# EAGLE design BLT_Small_Inflight_PCB_Oct_4 (EAGLE 9.6.2)
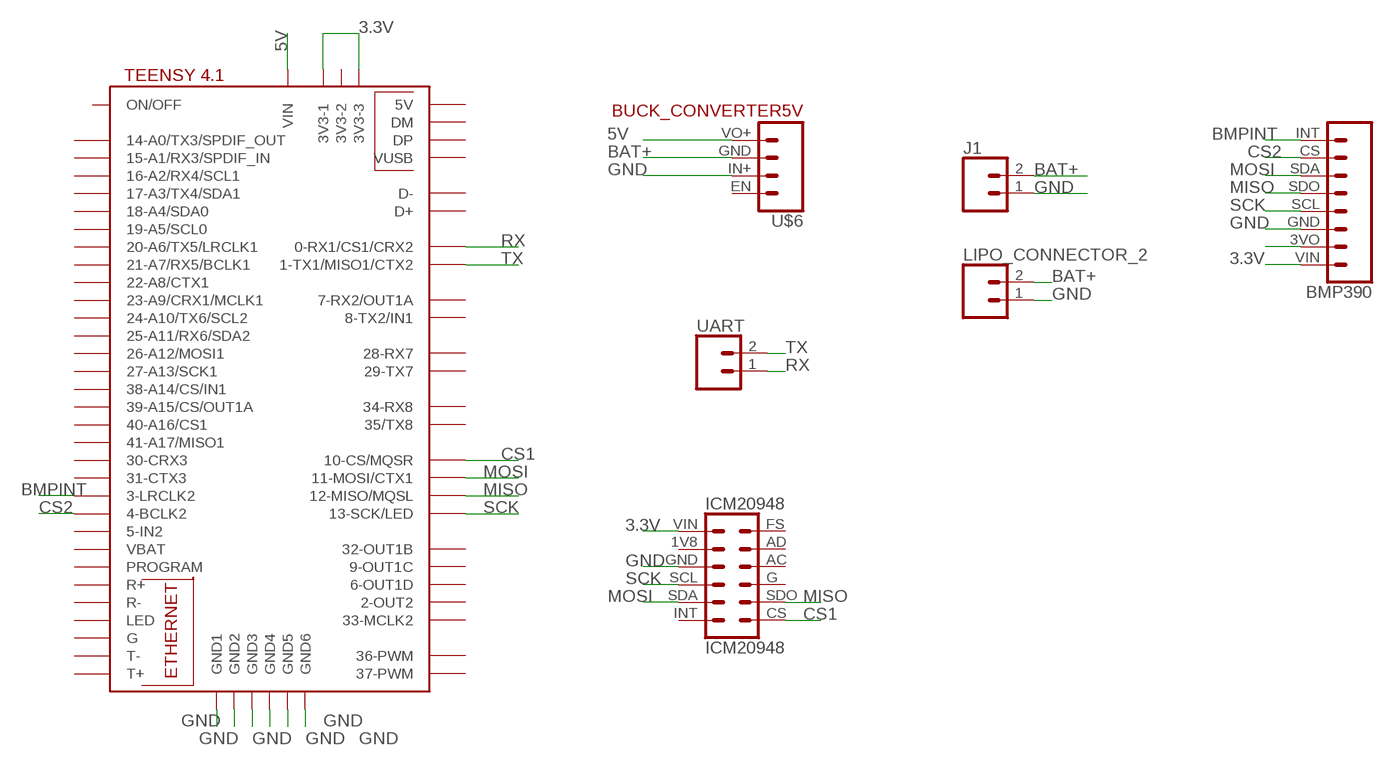
[diagram p0: schematic, sheet 1]

## Parts
J1  CONN_02PTH4  [1X02_XTRA_BIG]
LIPO_CONNECTOR_2  CONN_02  [1X02]
U$1  TEENSY41  [TEENSY41]
U$2  BMP390  [MICROBUILDER_1X08_ROUND]
U$3  ICM20948  [ICM20948]
U$6  BUCK_CONVERTER5V  [1X04]
UART  CONN_02  [1X02]

## Nets
3.3V: U$1.3V3-1 U$1.3V3-3 U$2.VIN U$3.VIN
5V: U$1.VIN U$6.VO+
BAT+: J1.2 LIPO_CONNECTOR_2.2 U$6.IN+
BMPINT: U$1.3-LRCLK2 U$2.INT
CS1: U$1.10-CS\MQSR(10-CS/MQSR) U$3.CS
CS2: U$1.4-BCLK2 U$2.CS
GND: J1.1 LIPO_CONNECTOR_2.1 U$1.GND1 U$1.GND2 U$1.GND3 U$1.GND4 U$1.GND5 U$1.GND6 U$2.GND U$3.GND U$6.GND
MISO: U$1.12-MISO/MQSL U$2.SDO U$3.SDO(SD0)
MOSI: U$1.11-MOSI/CTX1 U$2.SDA U$3.SDA
N$13: U$2.3VO
RX: U$1.0-RX1/CS1/CRX2 UART.1
SCK: U$1.13-SCK/LED U$2.SCL U$3.SCL
TX: U$1.1-TX1/MISO1/CTX2 UART.2
Unconnected: U$1.2-OUT2 U$1.3V3-2 U$1.5-IN2 U$1.6-OUT1D U$1.7-RX2/OUT1A U$1.8-TX2/IN1 U$1.9-OUT1C U$1.14-A0/TX3/SPDIF_OUT U$1.15-A1/RX3/SPDIF_IN U$1.16-A2/RX4/SCL1 U$1.17-A3/TX4/SDA1 U$1.18-A4/SDA0 U$1.19-A5/SCL0 U$1.20-A6/TX5/LRCLK1 U$1.21-A7/RX5/BCLK1 U$1.22-A8/CTX1 U$1.23-A9/CRX1/MCLK1 U$1.24-A10/TX6/SCL2 U$1.25-A11/RX6/SDA2 U$1.26-A12/MOSI1 U$1.27-A13/SCK1 U$1.28-RX7 U$1.29-TX7 U$1.30-CRX3 U$1.31-CTX3 U$1.32-OUT1B U$1.33-MCLK2 U$1.34-RX8 U$1.35-TX8(35/TX8) U$1.36-PWM U$1.37-PWM U$1.38-A14/CS/IN1 U$1.39-A15/CS/OUT1A U$1.40-A16/CS1 U$1.41-A17/MISO1 U$1.+5V(5V) U$1.D+ U$1.D- U$1.DM U$1.DP U$1.G U$1.LED U$1.ON/OFF U$1.PROGRAM U$1.R+ U$1.R- U$1.T+ U$1.T- U$1.VBAT U$1.VUSB U$3.1V8 U$3.AC U$3.AD U$3.FS U$3.G U$3.INT U$6.EN

## Library data of the parts
J1 LIPO_CONNECTOR_2 UART = SparkFun-Connectors:CONN_02: Multi connection point. Often used as Generic Header-pin footprint for 0.1 inch spaced/style header connections On any of the 0.1 inch spaced packages, you can populate with these: Break Away Headers - Straight <https://www.sparkfun.com/products/116> (PRT-00116) Break Away Male Headers - Right Angle <https://www.sparkfun.com/products/553> (PRT-00553) Female Headers <https://www.sparkfun.com/products/115> (PRT-00115) Break Away Headers - Machine Pin <https://www.sparkfun.com/products/117> (PRT-00117) Break Away Female Headers - Swiss Machine Pin <https://www.sparkfun.com/products/743> (PRT-00743) For SCREWTERMINALS and SPRING TERMINALS visit here: Screw Terimnals on SparkFun.com <https://www.sparkfun.com/search/results?term=Screw+Terminals> (5mm/3.5mm/2.54mm spacing) This device is also useful as a general connection point to wire up your design to another part of your project. Our various solder wires solder well into these plated through hole pads. Hook-Up Wire - Assortment (Stranded, 22 AWG) <https://www.sparkfun.com/products/11375> (PRT-11375) Hook-Up Wire - Assortment (Solid Core, 22 AWG) <https://www.sparkfun.com/products/11367> (PRT-11367) View the entire wire category on our website here <https://www.sparkfun.com/categories/141> Special notes: Molex polarized connector foot print use with: PRT-08233 with associated crimp pins and housings. 2.54_SCREWTERM for use with PRT-10571. 3.5mm Screw Terminal footprints for PRT-08084 5mm Screw Terminal footprints for use with PRT-08432
U$1 = teensy:TEENSY41
U$2 = BLTFootprints:BMP390
U$3 = ICM20948:ICM20948
U$6 = BLTFootprints:BUCK_CONVERTER; VOLTAGE: 5V

## Board
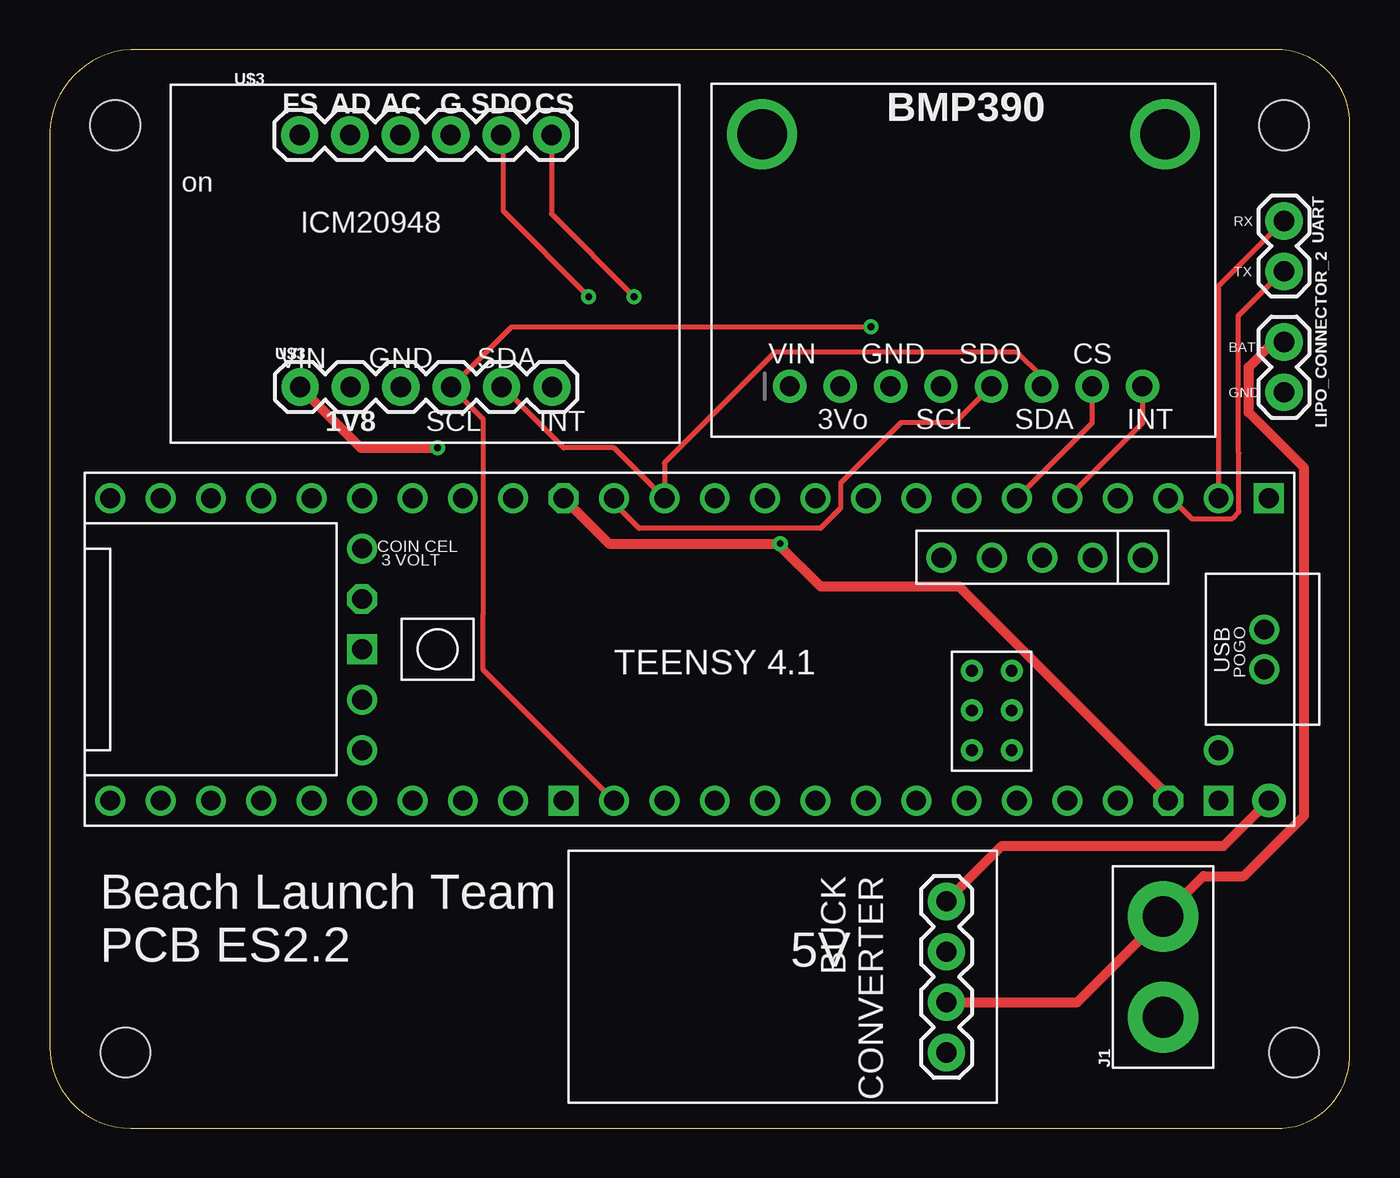
[diagram p1: board, top side]
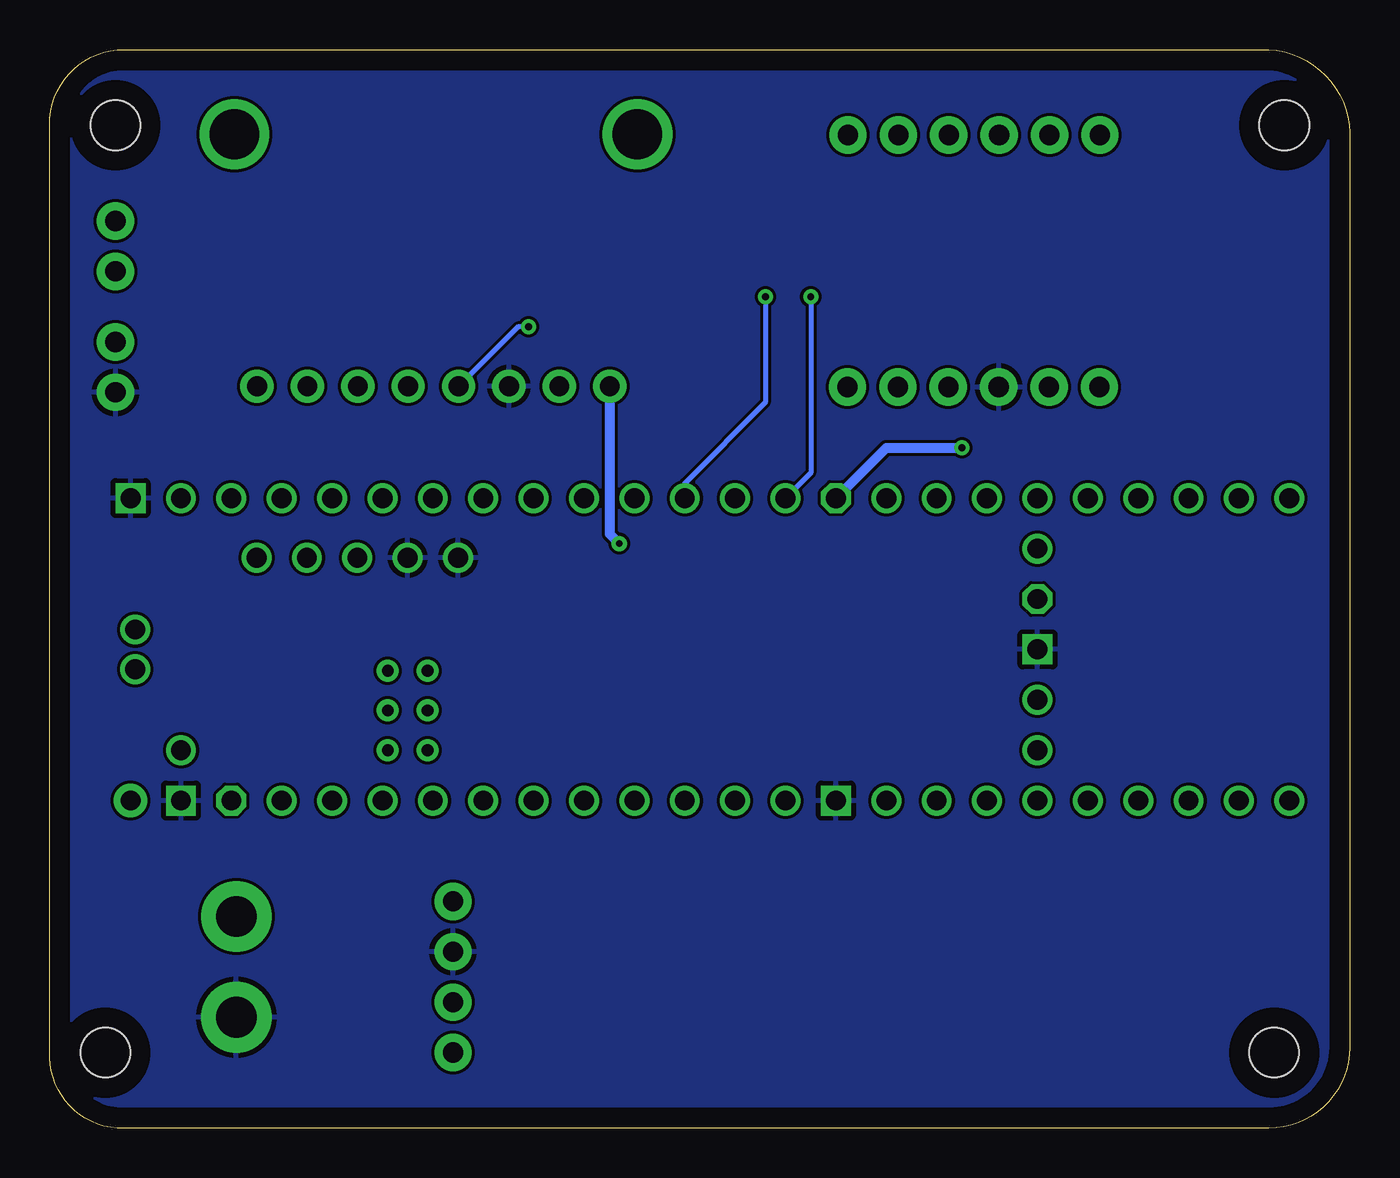
[diagram p2: board, bottom side, seen from below]

Size 65.56 x 54.36 mm. Coordinates in mm from the lower left corner, seen from the top.
Outline: 0,49.77 0,4.08 arc90 4.09,0 62.15,0 arc90 65.54,3.89 65.54,50.21 arc90 62.15,54.36 4.09,54.36 arc90 0,49.77
Copper layers (1*16): Top 0.035mm / dielectric 1.5mm / Bottom 0.035mm
Design rules "default": minimum track width 6mil, minimum drill 0.35mm, track to track 6mil, track to pad 6mil, pad to pad 6mil, via to via 6mil, smd to smd 6mil, copper to edge 40mil, drill to drill 6mil, minimum pad ring 10mil, minimum via ring 8mil, stop-mask expansion 4mil, vias tented up to drill 0mil, thermal gap 10mil
Holes 2.5 mm at 3.31,50.55 3.81,3.81 62.23,50.55 62.74,3.81

### Footprints (pad centres in the part's own frame; a part is rotated, then mirrored left to right if it is on the bottom)
1X02_XTRA_BIG = drill 2.057 pad 3.556: 1 -2.54,0; 2 2.54,0
1X02 = drill 1.016 pad 1.88: 1 0,0; 2 2.54,0
TEENSY41 = drill 1: 0-RX1/CS1/CRX2 -27.94,-7.62; 1-TX1/MISO1/CTX2 -25.4,-7.62; 2-OUT2 -22.86,-7.62; 3-LRCLK2 -20.32,-7.62; 4-BCLK2 -17.78,-7.62; 5-IN2 -15.24,-7.62; 6-OUT1D -12.7,-7.62; 7-RX2/OUT1A -10.16,-7.62; 8-TX2/IN1 -7.62,-7.62; 9-OUT1C -5.08,-7.62; 10-CS\MQSR -2.54,-7.62; 11-MOSI/CTX1 0,-7.62; 12-MISO/MQSL 2.54,-7.62; 13-SCK/LED 2.54,7.62; 14-A0/TX3/SPDIF_OUT 0,7.62; 15-A1/RX3/SPDIF_IN -2.54,7.62; 16-A2/RX4/SCL1 -5.08,7.62; 17-A3/TX4/SDA1 -7.62,7.62; 18-A4/SDA0 -10.16,7.62; 19-A5/SCL0 -12.7,7.62; 20-A6/TX5/LRCLK1 -15.24,7.62; 21-A7/RX5/BCLK1 -17.78,7.62; 22-A8/CTX1 -20.32,7.62; 23-A9/CRX1/MCLK1 -22.86,7.62; 24-A10/TX6/SCL2 7.62,-7.62; 25-A11/RX6/SDA2 10.16,-7.62; 26-A12/MOSI1 12.7,-7.62; 27-A13/SCK1 15.24,-7.62; 28-RX7 17.78,-7.62; 29-TX7 20.32,-7.62; 30-CRX3 22.86,-7.62; 31-CTX3 25.4,-7.62; 32-OUT1B 27.94,-7.62; 33-MCLK2 27.94,7.62; 34-RX8 25.4,7.62; 35-TX8 22.86,7.62; 36-PWM 20.32,7.62; 37-PWM 17.78,7.62; 38-A14/CS/IN1 15.24,7.62; 39-A15/CS/OUT1A 12.7,7.62; 40-A16/CS1 10.16,7.62; 41-A17/MISO1 7.62,7.62; +5V -24.13,-4.62; D+ -30.25,-1; D- -30.25,1; DM -21.59,-4.62; DP -19.05,-4.62; GND4 -16.51,-4.62; GND5 -13.97,-4.62; ON/OFF 15.24,5.08; PROGRAM 15.24,2.54; VBAT 15.24,-5.08; VUSB -27.94,5.08 | drill 1 octagon: 3V3-1 5.08,-7.62; 3V3-2 15.24,-2.54; 3V3-3 -25.4,7.62 | drill 0.6: G -15.51,3.08; LED -17.51,3.08; R+ -17.51,5.08; R- -15.51,5.08; T+ -15.51,1.08; T- -17.51,1.08 | drill 1 square: GND1 -30.48,-7.62; GND2 15.24,0; GND3 5.08,7.62; GND6 -27.94,7.62 | drill 1 pad 1.676: VIN -30.48,7.62
MICROBUILDER_1X08_ROUND = drill 1 pad 1.676: 3VO -6.223,0; CS 6.477,0; GND -3.683,0; INT 9.017,0; SCL -1.143,0; SDA 3.937,0; SDO 1.397,0; VIN -8.763,0 | drill 2.5 pad 3.2: P$1 -10.16,12.7; P$2 10.16,12.7
ICM20948 = drill 1.016 pad 1.88: 1V8 11.862,-6.591; AC 14.376,6.109; AD 11.836,6.109; CS 21.996,6.109; FS 9.296,6.109; G 16.916,6.109; GND 14.402,-6.591; INT 22.022,-6.591; SCL 16.942,-6.591; SDA 19.482,-6.591; SDO 19.456,6.109; VIN 9.322,-6.591
1X04 = drill 1.016 pad 1.88: EN 7.62,0; GND 2.54,0; IN+ 5.08,0; VO+ 0,0

### Placement (x,y rotation side)
J1  56.14,8.13 90 top
LIPO_CONNECTOR_2  62.23,37.08 90 top
U$1  30.99,24.13 180 top
U$2  46.08,37.39 0 top
U$3  3.31,43.94 0 top
U$6  45.22,11.43 270 top
UART  62.23,45.72 270 top

### Tracks (layer width: path | path; a pad name or v marks a point on that pad's centre or on a via)
3.3V  (via drill 0.35)
  Top 0.508: U$1.3V3-3 56.39,16.76 45.85,27.3 38.87,27.3 36.83,29.34 v36.83,29.46 28.2,29.46 U$1.3V3-1 | U$3.VIN 15.69,34.29 v19.56,34.29
  Bottom 0.508: U$1.3V3-1 23.37,34.29 v19.56,34.29 | 37.34,37.36 U$2.VIN 37.32,29.95 v36.83,29.46
5V
  Top 0.508: U$6.VO+ 48.01,14.22 59.19,14.22 U$1.VIN
BAT+
  Top 0.508: LIPO_CONNECTOR_2.2 61.73,39.62 60.46,38.35 60.46,36.07 63.25,33.27 63.25,15.75 60.2,12.7 58.17,12.7 J1.2 51.82,6.35 U$6.IN+
BMPINT
  Top 0.254: U$2.INT 55.1,35.53 U$1.3-LRCLK2
CS1  (via drill 0.35)
  Top 0.254: U$3.CS 25.3,46.08 v29.47,41.91
  Bottom 0.254: U$1.10-CS\MQSR 33.53,32.51 29.47,36.58 v29.47,41.91
CS2
  Top 0.254: U$2.CS 52.56,35.53 U$1.4-BCLK2
GND
  pour Bottom: 65.54,5.06 65.54,49.6 arc90 61.2,53.94 4.33,54.08 arc90 0,49.76 0,4.81 arc90 4.81,0 60.48,0 arc90
MISO  (via drill 0.35)
  Top 0.254: U$2.SDO 45.65,35.56 42.93,35.56 39.88,32.51 39.88,31.24 38.87,30.23 29.72,30.23 28.45,31.5 U$1.12-MISO/MQSL | U$3.SDO 22.86,49.95 22.86,46.23 v27.18,41.91
  Bottom 0.254: v27.18,41.91 27.18,33.02 U$1.12-MISO/MQSL
MOSI
  Top 0.254: U$3.SDA 22.85,37.35 25.91,34.29 28.45,34.29 U$1.11-MOSI/CTX1 30.99,33.53 36.58,39.12 48.77,39.12 50.02,37.87 U$2.SDA
RX
  Top 0.254: UART.1 58.93,42.42 U$1.0-RX1/CS1/CRX2
SCK  (via drill 0.35)
  Top 0.254: v41.41,40.39 23.28,40.39 U$3.SCL 21.87,35.73 21.87,25.92 21.87,23.1 26.67,18.29 26.93,18.03 U$1.13-SCK/LED
  Bottom 0.254: v41.41,40.39 41.94,40.39 U$2.SCL
TX
  Top 0.152: 62.17,43.18 UART.2
  Top 0.254: U$1.1-TX1/MISO1/CTX2 56.55,31.75 57.58,30.72 59.61,30.72 59.97,31.07 59.97,34.03 59.92,34.07 59.92,40.93 62.17,43.18

### Text on the board
tPlace: RX | TX | BAT+ | GND | Beach Launch Team / PCB ES2.2 | 5V